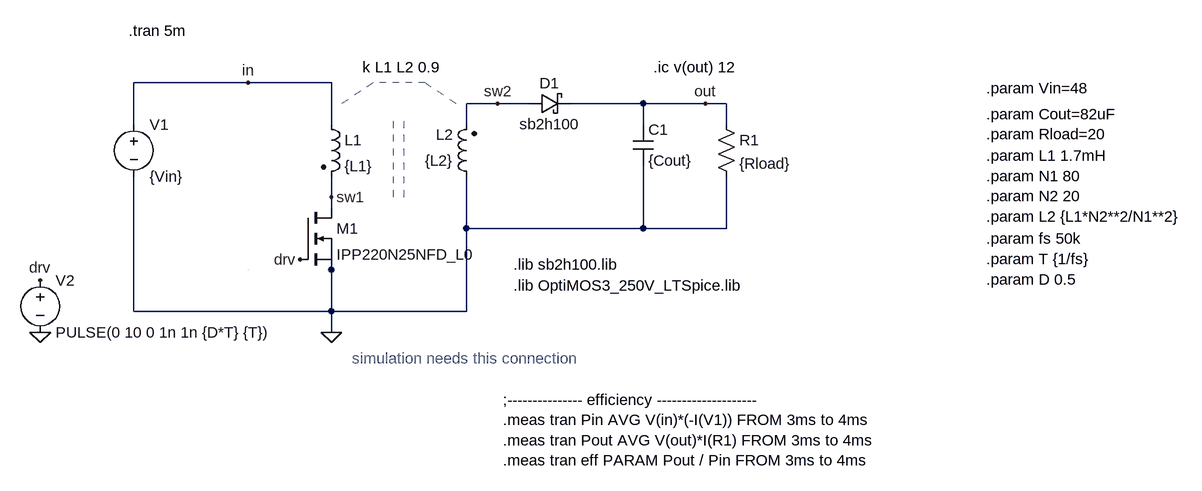
[diagram p0: schematic flyback_real_tran.asc]
flyback_real_tran.asc, the LTspice schematic file:
Version 4
SHEET 1 1516 764
WIRE 16 64 -160 64
WIRE 144 64 16 64
WIRE 400 96 352 96
WIRE 448 96 400 96
WIRE 624 96 512 96
WIRE 720 96 624 96
WIRE 752 96 720 96
WIRE -160 128 -160 64
WIRE 144 128 144 64
WIRE 352 128 352 96
WIRE 624 128 624 96
WIRE 752 128 752 96
WIRE 144 240 144 208
WIRE 144 256 144 240
WIRE 352 288 352 208
WIRE 624 288 624 192
WIRE 624 288 352 288
WIRE 752 288 752 208
WIRE 752 288 624 288
WIRE 144 352 144 336
WIRE -160 416 -160 208
WIRE 144 416 144 352
WIRE 144 416 -160 416
WIRE 352 416 352 288
WIRE 352 416 144 416
WIRE 144 448 144 416
FLAG 144 448 0
FLAG 96 336 drv
FLAG -304 448 0
FLAG -304 368 drv
FLAG 720 96 out
FLAG 16 64 in
FLAG 400 96 sw2
FLAG 144 240 sw1
SYMBOL ind2 128 112 R0
SYMATTR InstName L1
SYMATTR Value {L1}
SYMATTR Type ind
SYMATTR SpiceLine Rser=1.2
SYMBOL ind2 368 224 R180
WINDOW 0 36 80 Left 2
WINDOW 3 36 40 Left 2
SYMATTR InstName L2
SYMATTR Value {L2}
SYMATTR Type ind
SYMBOL schottky 448 112 R270
WINDOW 0 32 32 VTop 2
WINDOW 3 0 32 VBottom 2
SYMATTR InstName D1
SYMATTR Value sb2h100
SYMATTR Description Diode
SYMATTR Type diode
SYMATTR Prefix X
SYMBOL cap 608 128 R0
SYMATTR InstName C1
SYMATTR Value {Cout}
SYMBOL res 736 112 R0
SYMATTR InstName R1
SYMATTR Value {Rload}
SYMBOL voltage -160 112 R0
SYMATTR InstName V1
SYMATTR Value {Vin}
SYMBOL voltage -304 352 R0
WINDOW 123 0 0 Left 0
WINDOW 39 0 0 Left 0
SYMATTR InstName V2
SYMATTR Value PULSE(0 10 0 1n 1n {D*T} {T})
SYMBOL nmos 96 256 R0
SYMATTR InstName M1
SYMATTR Value IPP220N25NFD_L0
SYMATTR Prefix X
TEXT 192 40 Left 2 !k L1 L2 0.9
TEXT 1152 304 Left 2 !.param fs 50k\n.param T {1/fs}\n.param D 0.5
TEXT -168 -16 Left 2 !.tran 5m
TEXT 1152 176 Left 2 !.param L1 1.7mH\n.param N1 80\n.param N2 20\n.param L2 {L1*N2**2/N1**2}
TEXT 1152 112 Left 2 !.param Cout=82uF\n.param Rload=20
TEXT 1152 72 Left 2 !.param Vin=48
TEXT 176 488 Left 2 ;simulation needs this connection
TEXT 408 552 Left 2 !;--------------- efficiency --------------------\n.meas tran Pin AVG V(in)*(-I(V1)) FROM 3ms to 4ms\n.meas tran Pout AVG V(out)*I(R1) FROM 3ms to 4ms\n.meas tran eff PARAM Pout / Pin FROM 3ms to 4ms
TEXT 640 40 Left 2 !.ic v(out) 12
TEXT 424 344 Left 2 !.lib sb2h100.lib
TEXT 424 376 Left 2 !.lib OptiMOS3_250V_LTSpice.lib
LINE Normal 16 352 16 352 2
LINE Normal 16 352 16 352 2
LINE Normal 240 240 240 112 3
LINE Normal 240 240 240 240 2
LINE Normal 256 240 256 112 3
LINE Normal 256 240 256 240 2
LINE Normal 208 64 160 96 2
LINE Normal 288 64 208 64 2
LINE Normal 336 96 288 64 2
LINE Normal 336 96 336 96 2

The netlist it stands for:
* flyback_real_tran.asc
L1 in sw1 {L1} Rser=1.2
L2 0 sw2 {L2}
XD1 sw2 out sb2h100  ; pins + -
C1 out 0 {Cout}
R1 out 0 {Rload}
V1 in 0 {Vin}
V2 drv 0 PULSE(0 10 0 1n 1n {D*T} {T})
XM1 sw1 drv 0 IPP220N25NFD_L0  ; pins D G S
k L1 L2 0.9
.param fs 50k
.param T {1/fs}
.param D 0.5
.tran 5m
.param L1 1.7mH
.param N1 80
.param N2 20
.param L2 {L1*N2**2/N1**2}
.param Cout=82uF
.param Rload=20
.param Vin=48
* simulation needs this connection
;--------------- efficiency --------------------
.meas tran Pin AVG V(in)*(-I(V1)) FROM 3ms to 4ms
.meas tran Pout AVG V(out)*I(R1) FROM 3ms to 4ms
.meas tran eff PARAM Pout / Pin FROM 3ms to 4ms
.ic v(out) 12
.lib sb2h100.lib
.lib OptiMOS3_250V_LTSpice.lib
.backanno
.end